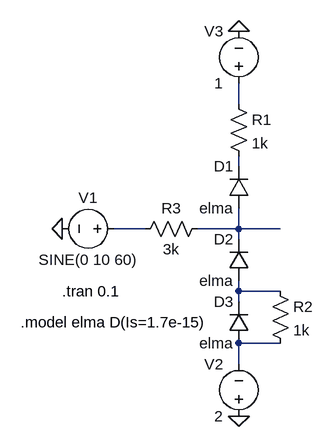
[diagram p0: schematic Draft2.asc]
Draft2.asc, the LTspice schematic file:
Version 4
SHEET 1 880 680
WIRE 176 -16 176 -48
WIRE 176 80 176 64
WIRE 32 176 -16 176
WIRE 176 176 176 144
WIRE 176 176 112 176
WIRE 240 176 176 176
WIRE 176 192 176 176
WIRE 176 272 176 256
WIRE 240 272 176 272
WIRE 176 288 176 272
WIRE 240 352 176 352
WIRE 176 384 176 352
FLAG 176 464 0
FLAG 176 -128 0
FLAG -96 176 0
SYMBOL res 160 -32 R0
SYMATTR InstName R1
SYMATTR Value 1k
SYMBOL diode 192 144 R180
WINDOW 0 24 64 Left 2
WINDOW 3 24 0 Left 2
SYMATTR InstName D1
SYMATTR Value elma
SYMBOL diode 192 256 R180
WINDOW 0 24 64 Left 2
WINDOW 3 24 0 Left 2
SYMATTR InstName D2
SYMATTR Value elma
SYMBOL diode 192 352 R180
WINDOW 0 24 64 Left 2
WINDOW 3 24 0 Left 2
SYMATTR InstName D3
SYMATTR Value elma
SYMBOL res 224 256 R0
SYMATTR InstName R2
SYMATTR Value 1k
SYMBOL res 128 160 R90
WINDOW 0 0 56 VBottom 2
WINDOW 3 32 56 VTop 2
SYMATTR InstName R3
SYMATTR Value 3k
SYMBOL voltage 0 176 R90
WINDOW 0 -32 56 VBottom 2
WINDOW 3 32 56 VTop 2
SYMATTR InstName V1
SYMATTR Value SINE(0 10 60)
SYMBOL voltage 176 480 R180
WINDOW 0 24 96 Left 2
WINDOW 3 24 16 Left 2
WINDOW 123 0 0 Left 2
WINDOW 39 0 0 Left 2
SYMATTR InstName V2
SYMATTR Value 2
SYMBOL voltage 176 -32 R180
WINDOW 0 24 96 Left 2
WINDOW 3 24 16 Left 2
WINDOW 123 0 0 Left 2
WINDOW 39 0 0 Left 2
SYMATTR InstName V3
SYMATTR Value 1
TEXT -160 320 Left 2 !.model elma D(Is=1.7e-15)
TEXT -96 272 Left 2 !.tran 0.1

The netlist it stands for:
* Draft2.asc
R1 N001 N002 1k
D1 N004 N002 elma
D2 N005 N004 elma
D3 N006 N005 elma
R2 N005 N006 1k
R3 N004 N003 3k
V1 N003 0 SINE(0 10 60)
V2 0 N006 2
V3 N001 0 1
.model D D
.lib standard.dio
.model elma D(Is=1.7e-15)
.tran 0.1
.backanno
.end